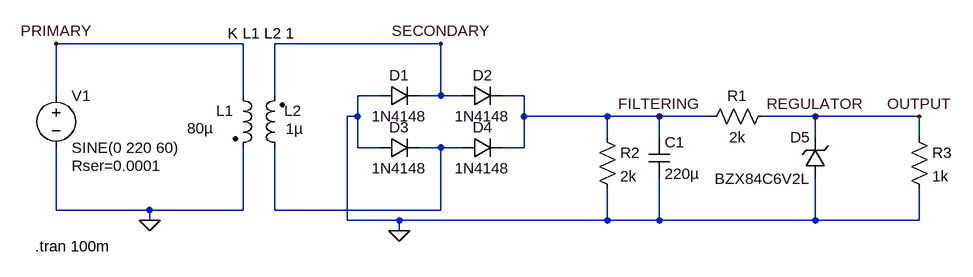
[diagram p0: schematic PowerSupply.asc]
PowerSupply.asc, the LTspice schematic file:
Version 4
SHEET 1 1504 680
WIRE 384 64 96 64
WIRE 688 64 432 64
WIRE 96 144 96 64
WIRE 384 144 384 64
WIRE 432 144 432 64
WIRE 592 144 560 144
WIRE 688 144 688 64
WIRE 688 144 656 144
WIRE 720 144 688 144
WIRE 816 144 784 144
WIRE 560 176 560 144
WIRE 560 176 544 176
WIRE 816 176 816 144
WIRE 944 176 816 176
WIRE 1024 176 944 176
WIRE 1104 176 1024 176
WIRE 1264 176 1184 176
WIRE 1424 176 1264 176
WIRE 944 208 944 176
WIRE 1024 208 1024 176
WIRE 1264 208 1264 176
WIRE 1424 208 1424 176
WIRE 560 224 560 176
WIRE 592 224 560 224
WIRE 688 224 656 224
WIRE 720 224 688 224
WIRE 816 224 816 176
WIRE 816 224 784 224
WIRE 96 320 96 224
WIRE 240 320 96 320
WIRE 384 320 384 224
WIRE 384 320 240 320
WIRE 432 320 432 224
WIRE 688 320 688 224
WIRE 688 320 432 320
WIRE 240 336 240 320
WIRE 544 336 544 176
WIRE 624 336 544 336
WIRE 944 336 944 288
WIRE 944 336 624 336
WIRE 1024 336 1024 272
WIRE 1024 336 944 336
WIRE 1264 336 1264 272
WIRE 1264 336 1024 336
WIRE 1424 336 1424 288
WIRE 1424 336 1264 336
WIRE 624 352 624 336
FLAG 624 352 0
FLAG 240 336 0
FLAG 1024 176 FILTERING
FLAG 96 64 PRIMARY
FLAG 688 64 SECONDARY
FLAG 1264 176 REGULATOR
FLAG 1424 176 OUTPUT
SYMBOL voltage 96 128 R0
WINDOW 123 24 152 Left 2
WINDOW 39 24 124 Left 2
SYMATTR SpiceLine Rser=0.0001
SYMATTR InstName V1
SYMATTR Value SINE(0 220 60)
SYMBOL ind2 368 128 R0
WINDOW 0 -26 39 Left 2
WINDOW 3 -70 66 Left 2
SYMATTR InstName L1
SYMATTR Value 80µ
SYMATTR Type ind
SYMBOL ind2 448 240 R180
WINDOW 0 -26 73 Left 2
WINDOW 3 -28 45 Left 2
SYMATTR InstName L2
SYMATTR Value 1µ
SYMATTR Type ind
SYMBOL diode 592 160 R270
WINDOW 0 32 32 VTop 2
WINDOW 3 0 32 VBottom 2
SYMATTR InstName D1
SYMATTR Value 1N4148
SYMBOL diode 720 160 R270
WINDOW 0 32 32 VTop 2
WINDOW 3 0 32 VBottom 2
SYMATTR InstName D2
SYMATTR Value 1N4148
SYMBOL diode 592 240 R270
WINDOW 0 32 32 VTop 2
WINDOW 3 0 32 VBottom 2
SYMATTR InstName D3
SYMATTR Value 1N4148
SYMBOL diode 720 240 R270
WINDOW 0 32 32 VTop 2
WINDOW 3 0 32 VBottom 2
SYMATTR InstName D4
SYMATTR Value 1N4148
SYMBOL cap 1008 208 R0
SYMATTR InstName C1
SYMATTR Value 220µ
SYMBOL res 928 192 R0
SYMATTR InstName R2
SYMATTR Value 2k
SYMBOL res 1200 160 R90
WINDOW 0 0 56 VBottom 2
WINDOW 3 32 56 VTop 2
SYMATTR InstName R1
SYMATTR Value 2k
SYMBOL zener 1280 272 R180
WINDOW 0 24 64 Left 2
WINDOW 3 24 0 Left 2
SYMATTR InstName D5
SYMATTR Value BZX84C6V2L
SYMBOL res 1408 192 R0
SYMATTR InstName R3
SYMATTR Value 1k
TEXT 360 48 Left 2 !K L1 L2 1
TEXT 64 376 Left 2 !.tran 100m

The netlist it stands for:
* PowerSupply.asc
V1 PRIMARY 0 SINE(0 220 60) Rser=0.0001
L1 PRIMARY 0 80µ
L2 N001 SECONDARY 1µ
D1 0 SECONDARY 1N4148
D2 SECONDARY FILTERING 1N4148
D3 0 N001 1N4148
D4 N001 FILTERING 1N4148
C1 FILTERING 0 220µ
R2 FILTERING 0 2k
R1 OUTPUT FILTERING 2k
D5 0 OUTPUT BZX84C6V2L
R3 OUTPUT 0 1k
.model D D
.lib standard.dio
K L1 L2 1
.tran 100m
.backanno
.end

* Results of the author's LTspice run, read from the files saved beside the schematic
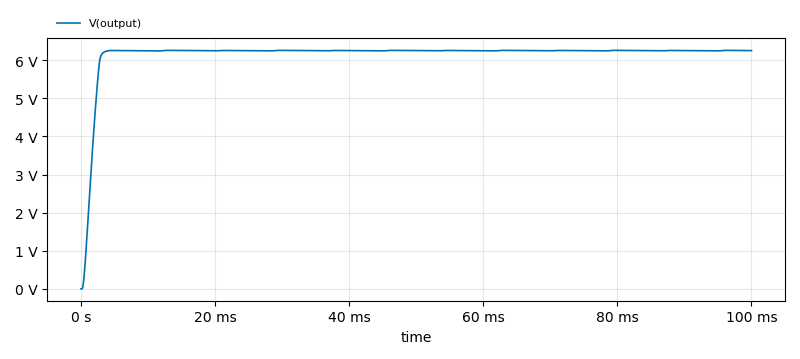
[diagram p1: Transient Analysis of PowerSupply.asc, plotted from the saved traces]
* Transient Analysis, 1 run:
*   V(output): min 0 V, max 6.258 V, average 6.154 V, rms 6.189 V, last 6.252 V